# Altium schematic sheet 09_Buzzer.SchDoc: Buzzer
size A; Revision: A; SheetNumber: 9; SheetTotal: 10; ECE315_Project_Name: ECE315 F23 Wack-A-Mole
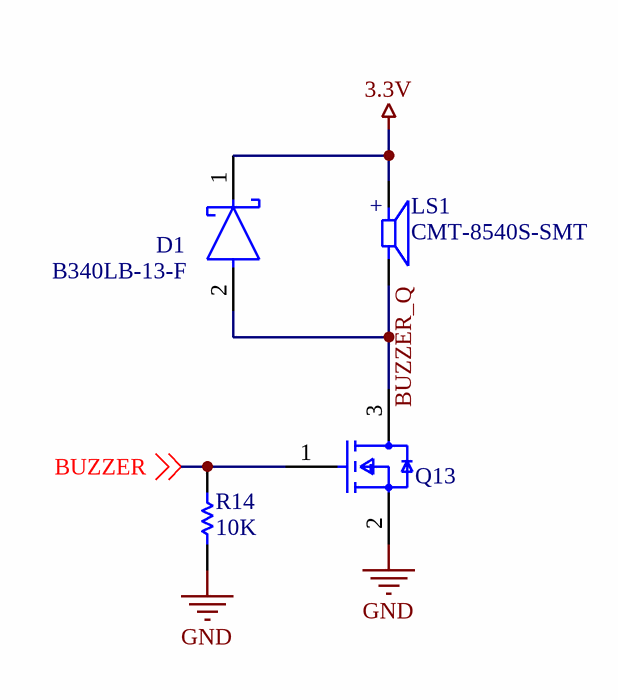
[diagram p0: 09_Buzzer.SchDoc]

## Parts
D1  B340LB-13-F  [FP-SMB-MFG]
LS1  CMT-8540S-SMT  [CUI_CMT-8540S-SMT]
Q13  2N7002-7-F  [FP-SOT23-MFG]  (value not drawn)
R14  Resistance: 10K  [RESC3116X65X40ML10T20]  (hidden comment: RC1206FR-0710KL)

## Nets
3.3V: D1.1(C) LS1.P
GND: Q13.2(S) R14.1
BUZZER: Q13.1(G) R14.2 ; off-sheet BUZZER
BUZZER_Q: D1.2(A) LS1.N Q13.3(D)

## Notes on the sheet
- Title:
- Size:
- A
- Project
- Rev:
- Sheet:
- of
- College of Engineering
- 1415 Engineering Drive
- Madison, WI 53706
- (in symbol CMT-8540S-SMT) +

## Library data of the parts
D1 = CMP-12790-000022-1: DIODE SCHOTTKY 40V 3A SMB; Manufacturer: Diodes Inc.; Max Surge Forward Current: 70A; Value: 180pF; Peak Reverse Current: 2mA; Standoff Height: 0.05mm; Max Junction Temp: +150°C; Forward Voltage: 450mV; Element Configuration: Single; Polarity: Standard; Device Class L2: Diodes; Octopart: https://octopart.com/b340lb-13-f-diodes+inc.-325823; Device Class L1: Discrete Semiconductors; Forward Current: 3A; Automotive: No; Manufacturer Part Number: B340LB-13-F; Temperature: -55°C to +150°C; Temperature Range Low: -55°C; Max Repetitive Reverse Voltage: 40V; Device Class L3: Schottky Diodes; RoHS: TRUE; Height: 2.5mm; ComponentLink2URL: https://www.diodes.com/assets/Datasheets/ds30240.pdf; Package: SMB; Digikey Description: DIODE SCHOTTKY 40V 3A SMB; Lead Free: Yes; Category: Diode; Reverse Voltage: 40V; Mouser Description: Schottky Diodes & Rectifiers 40V 3A; ComponentLink2Description: Datasheet; Footprint Url: https://www.diodes.com/assets/Package-Files/SMB.pdf; Temperature Range High: +150°C; Capacitance: 180pF; Supplier 1: Digi-Key; Supplier Part Number 1: B340LB-FDICT-ND; Stock 1: 168517; Pricing 1: 1=0.43000, 10=0.36500, 100=0.27250, 500=0.21414, 1000=0.16547 (USD); Mount: Surface Mount; Case/Package: SMB; Number of Pins: 2; Weight: 0.00328oz; Min Operating Temperature: -55°C; Max Operating Temperature: 125°C; Max Reverse Current: 2mA; Package Quantity: 3000; Packaging: Tape and Reel; Average Rectified Current: 3A; Max Repetitive Reverse Voltage (Vrrm): 40V; Peak Non-Repetitive Surge Current: 70A; Max Forward Surge Current (Ifsm): 70A; Max Reverse Voltage (DC): 40V; Series: -; Voltage Rating (DC): 40V; Current Rating: 3A; Output Current: 3A; Termination: SMD/SMT; Current: 3A; Voltage: 40V; Length: 4.57mm; Width: 3.94mm; Radiation Hardening: No; Reach SVHC Compliant: Yes; RoHS Compliant: Yes; ComponentLink1URL: https://datasheet.ciiva.com/4715/ds30240-71143-4715794.pdf?src-supplier=Mouser; ComponentLink1Description: https://datasheet.ciiva.com/4715/ds30240-71143-4715794.pdf?src-supplier=Mouser; ComponentLink3URL: https://datasheet.ciiva.com/26949/getdatasheetpartid-146318-26949355.pdf?src-supplier=Verical; ComponentLink3Description: https://datasheet.ciiva.com/26949/getdatasheetpartid-146318-26949355.pdf?src-supplier=Verical; ComponentLink4URL: https://datasheet.ciiva.com/1177/ds30240-1177479.pdf?src-supplier=Element14; ComponentLink4Description: https://datasheet.ciiva.com/1177/ds30240-1177479.pdf?src-supplier=Element14; ComponentLink5URL: https://datasheet.ciiva.com/16380/ds30240-16380877.pdf?src-supplier=Future+Electronics; ComponentLink5Description: https://datasheet.ciiva.com/16380/ds30240-16380877.pdf?src-supplier=Future+Electronics; ComponentLink6URL: https://datasheet.ciiva.com/8303/ds30240-8303077.pdf?src-supplier=Avnet; ComponentLink6Description: https://datasheet.ciiva.com/8303/ds30240-8303077.pdf?src-supplier=Avnet; ComponentLink7URL: https://datasheet.ciiva.com/914/ds30240-914107.pdf?src-supplier=Digi-Key; ComponentLink7Description: https://datasheet.ciiva.com/914/ds30240-914107.pdf?src-supplier=Digi-Key; ComponentLink8URL: https://datasheet.ciiva.com/914/ds30240-914108.pdf?src-supplier=Digi-Key; ComponentLink8Description: https://datasheet.ciiva.com/914/ds30240-914108.pdf?src-supplier=Digi-Key; ComponentLink9URL: https://datasheet.ciiva.com/914/ds30240-914106.pdf?src-supplier=Digi-Key; ComponentLink9Description: https://datasheet.ciiva.com/914/ds30240-914106.pdf?src-supplier=Digi-Key; Supplier 2: Newark; Supplier Part Number 2: 12T1468
LS1 = CMT-8540S-SMT: AUDIO MAGNETIC XDCR 1-6V SMD; Manufacturer 1: CUI; MF: CUI Devices; MP: CMT-8540S-SMT-TR; Voltage Rating: 5V; Frequency: 4kHz; Operating Supply Current: 150mA; CUI_purchase_URL: https://www.cuidevices.com/product/audio/buzzers/audio-transducers/cmt-8540s-smt-tr?utm_source=snapeda.com&utm_medium=referral&utm_campaign=snapedaBOM; SnapEDA_Link: https://www.snapeda.com/parts/CMT-8540S-SMT-TR/CUI%20Devices/view-part/587791/?ref=snap; Availability: Unavailable; Package: CUI Inc.; Value: *; Price: None; Supplier 1: Digi-Key; Supplier Part Number 1: 102-3746-1-ND; Manufacturer Part Number 1: CMT-8540S-SMT-TR; RoHS: Yes; Category: Audio Products; Stock 1: 66147; Pricing 1: 1=3.23000, 10=2.67000, 25=2.46400, 50=2.31400, 100=2.16990, 500=1.91520 (USD); Min Operating Temperature: -20°C; Max Operating Temperature: 70°C; Sensing Method: Magnetic; Lead Free: Lead Free; ComponentLink1URL: https://www.cui.com/product/resource/digikeypdf/cmt-8540s-smt.pdf?src-supplier=Digi-Key; ComponentLink1Description: https://www.cui.com/product/resource/digikeypdf/cmt-8540s-smt.pdf?src-supplier=Digi-Key
Q13 = CMP-2000-04929-2: MOSFET N-CH 60V 115MA SOT23-3; Manufacturer 1: Diodes; Turn-On Delay Time: 7ns; Turn-Off Delay Time: 11ns; Drain to Source Resistance: 7.5R; Rise Time: 3ns; Drain to Source Breakdown Voltage: 70V; Input Capacitance: 50pF; Number of Elements: 1; Power Dissipation: 540mW; Max Power Dissipation: 300mW; Fall Time: 5.6ns; Gate to Source Voltage (Vgs): 20V; Threshold Voltage: 2.5V; Element Configuration: Single; Polarity: N-CHANNEL; Termination: SMD/SMT; Weight: 0.000282oz; Radiation Hardening: No; Max Operating Temperature: 150°C; On-State Resistance: 7.5R; Mount: Surface Mount; Current Rating: 115mA; Contact Plating: Tin; Lead Free: Lead Free; Min Operating Temperature: -55°C; Number of Pins: 3; REACH SVHC: No SVHC; Drain to Source Voltage (Vdss): 60V; Width: 1.3mm; Package Quantity: 3000; Length: 2.9mm; Case/Package: SOT-23; Number of Channels: 1; Dual Supply Voltage: 60V; Packaging: Tape and Reel; Height: 1mm; Voltage Rating (DC): 60V; Nominal Vgs: 2.5V; Continuous Drain Current (ID): 115mA; Voltage: 60V; Rds On Max: 7.5R; Supplier 1: Digi-Key; Supplier Part Number 1: 2N7002-FDICT-ND; Manufacturer Part Number 1: 2N7002-7-F; RoHS: Yes; Category: MOSFETs; Stock 1: 1441532; Pricing 1: 1=0.20000, 10=0.18600, 100=0.10140, 500=0.06236, 1000=0.04252 (USD); Series: -; Drain-source On Resistance-Max: 7.5R; Reach SVHC Compliant: Yes; RoHS Compliant: Yes; ComponentLink1URL: https://datasheet.ciiva.com/15219/getdatasheetpartid-110059-15219667.pdf?src-supplier=Verical; ComponentLink1Description: https://datasheet.ciiva.com/15219/getdatasheetpartid-110059-15219667.pdf?src-supplier=Verical; ComponentLink2URL: https://datasheet.ciiva.com/3304/ds11303-3304385.pdf?src-supplier=Avnet; ComponentLink2Description: https://datasheet.ciiva.com/3304/ds11303-3304385.pdf?src-supplier=Avnet; ComponentLink3URL: https://datasheet.ciiva.com/1188/ds11303-1188363.pdf?src-supplier=Element14; ComponentLink3Description: https://datasheet.ciiva.com/1188/ds11303-1188363.pdf?src-supplier=Element14; ComponentLink4URL: https://datasheet.ciiva.com/22712/1915452-22712375.pdf?src-supplier=Element14; ComponentLink4Description: https://datasheet.ciiva.com/22712/1915452-22712375.pdf?src-supplier=Element14; ComponentLink5URL: https://datasheet.ciiva.com/49020/70437206-49020102.pdf?src-supplier=Allied+Electronics; ComponentLink5Description: https://datasheet.ciiva.com/49020/70437206-49020102.pdf?src-supplier=Allied+Electronics
R14 = CMP-1014-00623-2: Chip Resistor, 10 KOhm, +/- 1%, 0.25 W, -55 to 155 degC, 1206 (3216 Metric), RoHS, Tape and Reel; Manufacturer: Yageo; Voltage Rating: 200V; Temperature Coefficient: 100ppm/degreesC; Power Rating: 250mW; Packaging: TapeandReel; Termination: SMD/SMT; REACH SVHC: Unknown; Tolerance: 1%; Height: 0.55mm; Composition: ThickFilm; Max Operating Temperature: 155degC; Datasheet Version: Rev. 5, 10/2016; Lead Free: LeadFree; Case Code (Metric): 3216; Depth: 1.6mm; Package Quantity: 5000; RoHSCompliant: true; Military Standard: Not; Case/Package: 1206; Case Code (Imperial): 1206; Min Operating Temperature: -55degC; Datasheet URL: http://www.yageo.com/NewPortal/yageodocoutput?fileName=/pdf/R-Chip/PYu-RC_Group_51_RoHS_L_5.pdf; Length: 3.1mm; Manufacturer URL: http://www.yageo.com/; Package Reference: 1206.0; Width: 1.6mm; Package Description: 2-Pin Surface Mount Device, Body 3.1 x 1.6 mm; Supplier 1: Digi-Key; Supplier Part Number 1: 311-10.0KFRCT-ND; Manufacturer Part Number: RC1206FR-0710KL; RoHS: Yes; Category: Chip SMD Resistors; Stock 1: 3827063; Pricing 1: 1=0.10000, 10=0.03700, 100=0.02040, 1000=0.01236, 2500=0.01036 (USD); Size Code: 1206; Series: RC; Resistance Tolerance: 1%; Resistor Type: Thick Film; Max Power Dissipation: 250mW; Number of Terminations: 2; Construction: Rectangular; Features: Moisture Resistant; RoHS Compliant: Yes; ComponentLink1URL: https://datasheet.ciiva.com/46445/444357-46445703.pdf?src-supplier=Element14; ComponentLink1Description: https://datasheet.ciiva.com/46445/444357-46445703.pdf?src-supplier=Element14; ComponentLink2URL: https://datasheet.ciiva.com/7857/1692832-7857244.pdf?src-supplier=Element14; ComponentLink2Description: https://datasheet.ciiva.com/7857/1692832-7857244.pdf?src-supplier=Element14; ComponentLink3URL: https://datasheet.ciiva.com/7857/1692832-7857245.pdf?src-supplier=Element14; ComponentLink3Description: https://datasheet.ciiva.com/7857/1692832-7857245.pdf?src-supplier=Element14; Supplier 2: Newark; Supplier Part Number 2: 98K7621